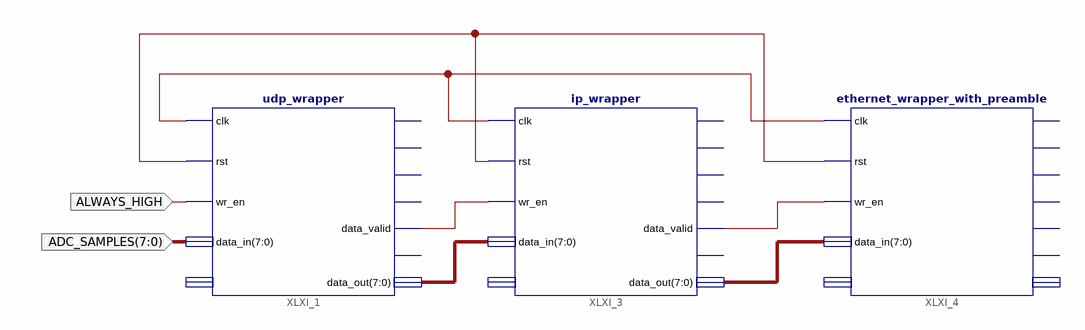
[diagram p0: schematic sheet 1]
// Xilinx ISE schematic presentation.sch (spartan6) as structural Verilog: 3 symbols, 2 ports
module presentation (
  input  ALWAYS_HIGH,
  input  [7:0] ADC_SAMPLES
);

  wire XLXN_16, XLXN_17, XLXN_20, XLXN_23;
  wire [7:0] XLXN_18, XLXN_19;

  udp_wrapper XLXI_1 (
    .clk(XLXN_16), .rst(XLXN_23), .wr_en(ALWAYS_HIGH), .data_in(ADC_SAMPLES), .data_valid(XLXN_17),
    .data_out(XLXN_18));  // open: buffer_prog_full_val, busy, buffer_full, buffer_empty, buffer_prog_full, dropped_frame
  ip_wrapper XLXI_3 (
    .clk(XLXN_16), .rst(XLXN_23), .wr_en(XLXN_17), .data_in(XLXN_18), .data_valid(XLXN_20), .data_out(XLXN_19));  // open: buffer_prog_full_val, busy, buffer_full, buffer_empty, buffer_prog_full, dropped_frame
  ethernet_wrapper_with_preamble XLXI_4 (
    .clk(XLXN_16), .rst(XLXN_23), .wr_en(XLXN_20), .data_in(XLXN_19));  // open: buffer_prog_full_val, busy, buffer_full, buffer_empty, buffer_prog_full, data_valid, dropped_frame, data_out
endmodule
